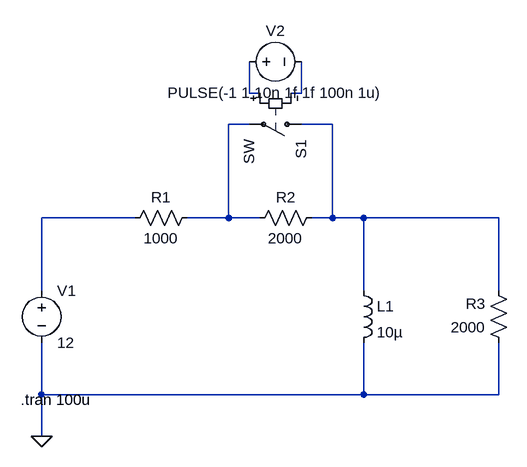
[diagram p0: schematic task_02_v01.asc]
task_02_v01.asc, the LTspice schematic file:
Version 4
SHEET 1 880 680
WIRE 256 -112 256 -160
WIRE 272 -112 256 -112
WIRE 336 -112 336 -160
WIRE 336 -112 320 -112
WIRE 256 -64 224 -64
WIRE 384 -64 336 -64
WIRE 80 80 -64 80
WIRE 224 80 224 -64
WIRE 224 80 160 80
WIRE 272 80 224 80
WIRE 384 80 384 -64
WIRE 384 80 352 80
WIRE 432 80 384 80
WIRE 640 80 432 80
WIRE -64 192 -64 80
WIRE 432 192 432 80
WIRE 640 192 640 80
WIRE -64 352 -64 272
WIRE 432 352 432 272
WIRE 432 352 -64 352
WIRE 640 352 640 272
WIRE 640 352 432 352
WIRE -64 416 -64 352
FLAG -64 416 0
SYMBOL res 176 64 R90
WINDOW 0 0 56 VBottom 2
WINDOW 3 32 56 VTop 2
SYMATTR InstName R1
SYMATTR Value 1000
SYMBOL res 368 64 R90
WINDOW 0 0 56 VBottom 2
WINDOW 3 32 56 VTop 2
SYMATTR InstName R2
SYMATTR Value 2000
SYMBOL res 656 288 R180
WINDOW 0 36 76 Left 2
WINDOW 3 36 40 Left 2
SYMATTR InstName R3
SYMATTR Value 2000
SYMBOL ind 416 176 R0
SYMATTR InstName L1
SYMATTR Value 10µ
SYMBOL voltage -64 176 R0
WINDOW 123 0 0 Left 0
WINDOW 39 0 0 Left 0
SYMATTR InstName V1
SYMATTR Value 12
SYMBOL sw 352 -64 R90
SYMATTR InstName S1
SYMBOL voltage 240 -160 R270
WINDOW 0 32 56 VTop 2
WINDOW 3 -32 56 VBottom 2
WINDOW 123 0 0 Left 0
WINDOW 39 0 0 Left 0
SYMATTR InstName V2
SYMATTR Value PULSE(-1 1 10n 1f 1f 100n 1u)
TEXT -96 360 Left 2 !.tran 100u

The netlist it stands for:
* task_02_v01.asc
R1 N003 N005 1000
R2 N004 N003 2000
R3 0 N004 2000
L1 N004 0 10µ
V1 N005 0 12
S1 N004 N003 N001 N002 SW
V2 N001 N002 PULSE(-1 1 10n 1f 1f 100n 1u)
.tran 100u
.backanno
.end